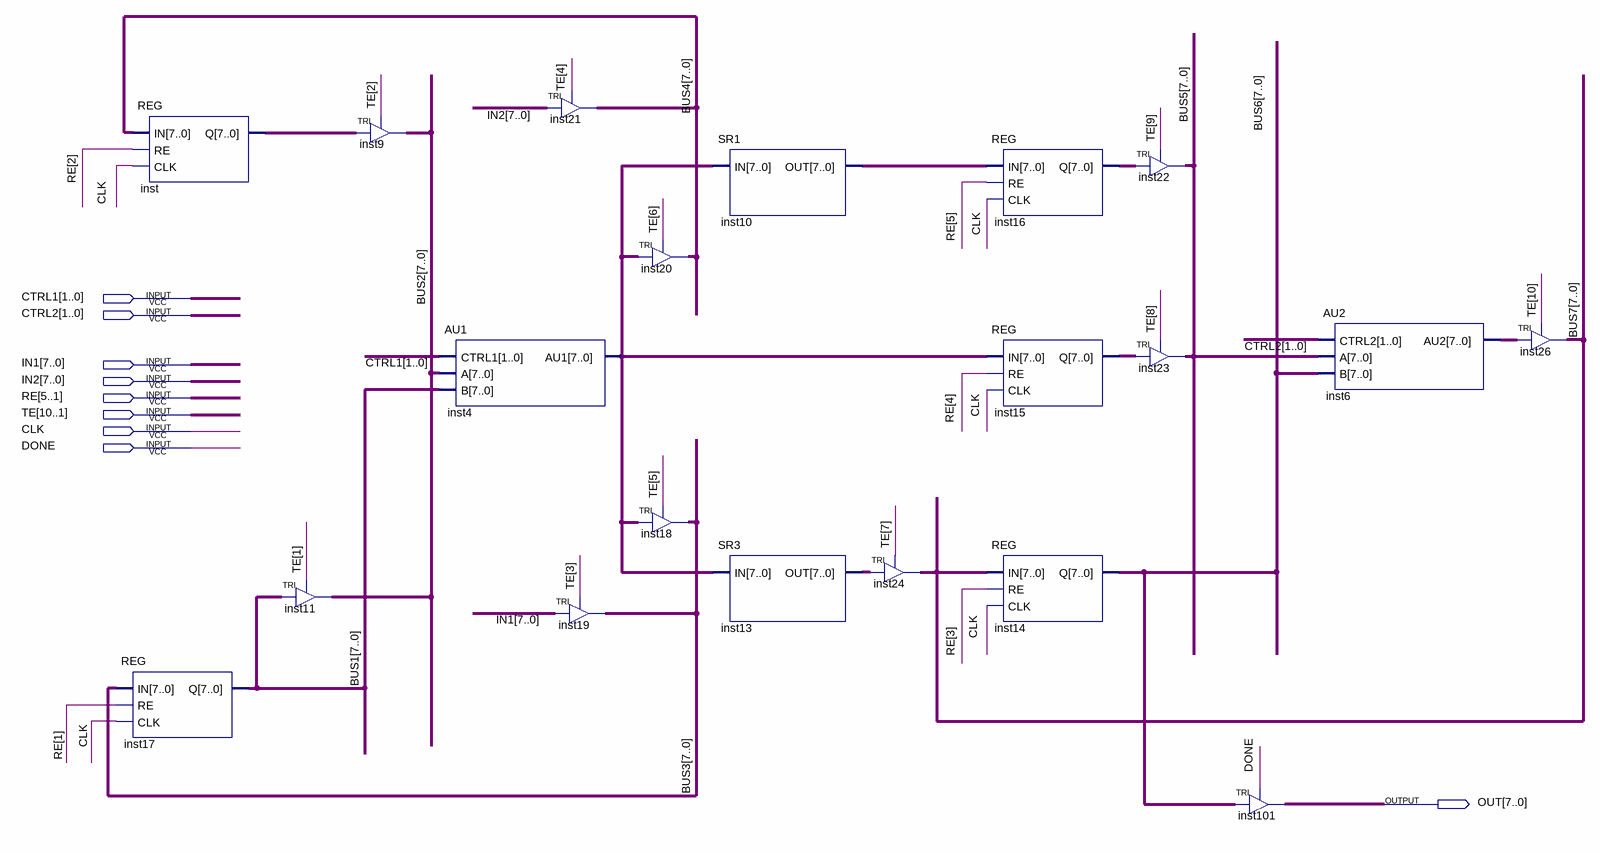
[diagram p0: schematic sheet]
// Quartus schematic DATAPATH.bdf as structural Verilog: 20 symbols, 9 pins
module DATAPATH (
  input  [1:0] CTRL1,
  input  [1:0] CTRL2,
  input  [7:0] IN1,
  input  [7:0] IN2,
  input  [5:1] RE,
  input  [10:1] TE,
  input  CLK,
  input  DONE,
  output [7:0] OUT
);

  wire [7:0] BUS1, BUS2, BUS3, BUS4, BUS5, BUS6, BUS7, inst4_au1, inst6_au2, inst10_out, inst13_out,
       inst15_q, inst16_q, inst_q;

  REG inst (.RE(RE[2]), .IN(BUS4), .CLK(CLK), .Q(inst_q));
  REG inst17 (.RE(RE[1]), .IN(BUS3), .CLK(CLK), .Q(BUS1));
  TRI inst11[7:0] (.IN(BUS1), .OE(TE[1]), .OUT(BUS2));
  TRI inst9[7:0] (.IN(inst_q), .OE(TE[2]), .OUT(BUS2));
  AU1 inst4 (.CTRL1(CTRL1), .A(BUS2), .B(BUS1), .AU1(inst4_au1));
  TRI inst21[7:0] (.IN(IN2), .OE(TE[4]), .OUT(BUS4));
  TRI inst19[7:0] (.IN(IN1), .OE(TE[3]), .OUT(BUS3));
  TRI inst20[7:0] (.IN(inst4_au1), .OE(TE[6]), .OUT(BUS4));
  TRI inst18[7:0] (.IN(inst4_au1), .OE(TE[5]), .OUT(BUS3));
  SR1 inst10 (.IN(inst4_au1), .OUT(inst10_out));
  SR3 inst13 (.IN(inst4_au1), .OUT(inst13_out));
  TRI inst24[7:0] (.IN(inst13_out), .OE(TE[7]), .OUT(BUS7));
  REG inst16 (.RE(RE[5]), .IN(inst10_out), .CLK(CLK), .Q(inst16_q));
  REG inst15 (.RE(RE[4]), .IN(inst4_au1), .CLK(CLK), .Q(inst15_q));
  REG inst14 (.RE(RE[3]), .IN(BUS7), .CLK(CLK), .Q(BUS6));
  TRI inst22[7:0] (.IN(inst16_q), .OE(TE[9]), .OUT(BUS5));
  TRI inst23[7:0] (.IN(inst15_q), .OE(TE[8]), .OUT(BUS5));
  TRI inst101[7:0] (.IN(BUS6), .OE(DONE), .OUT(OUT));
  AU2 inst6 (.CTRL2(CTRL2), .A(BUS5), .B(BUS6), .AU2(inst6_au2));
  TRI inst26[7:0] (.IN(inst6_au2), .OE(TE[10]), .OUT(BUS7));
endmodule
